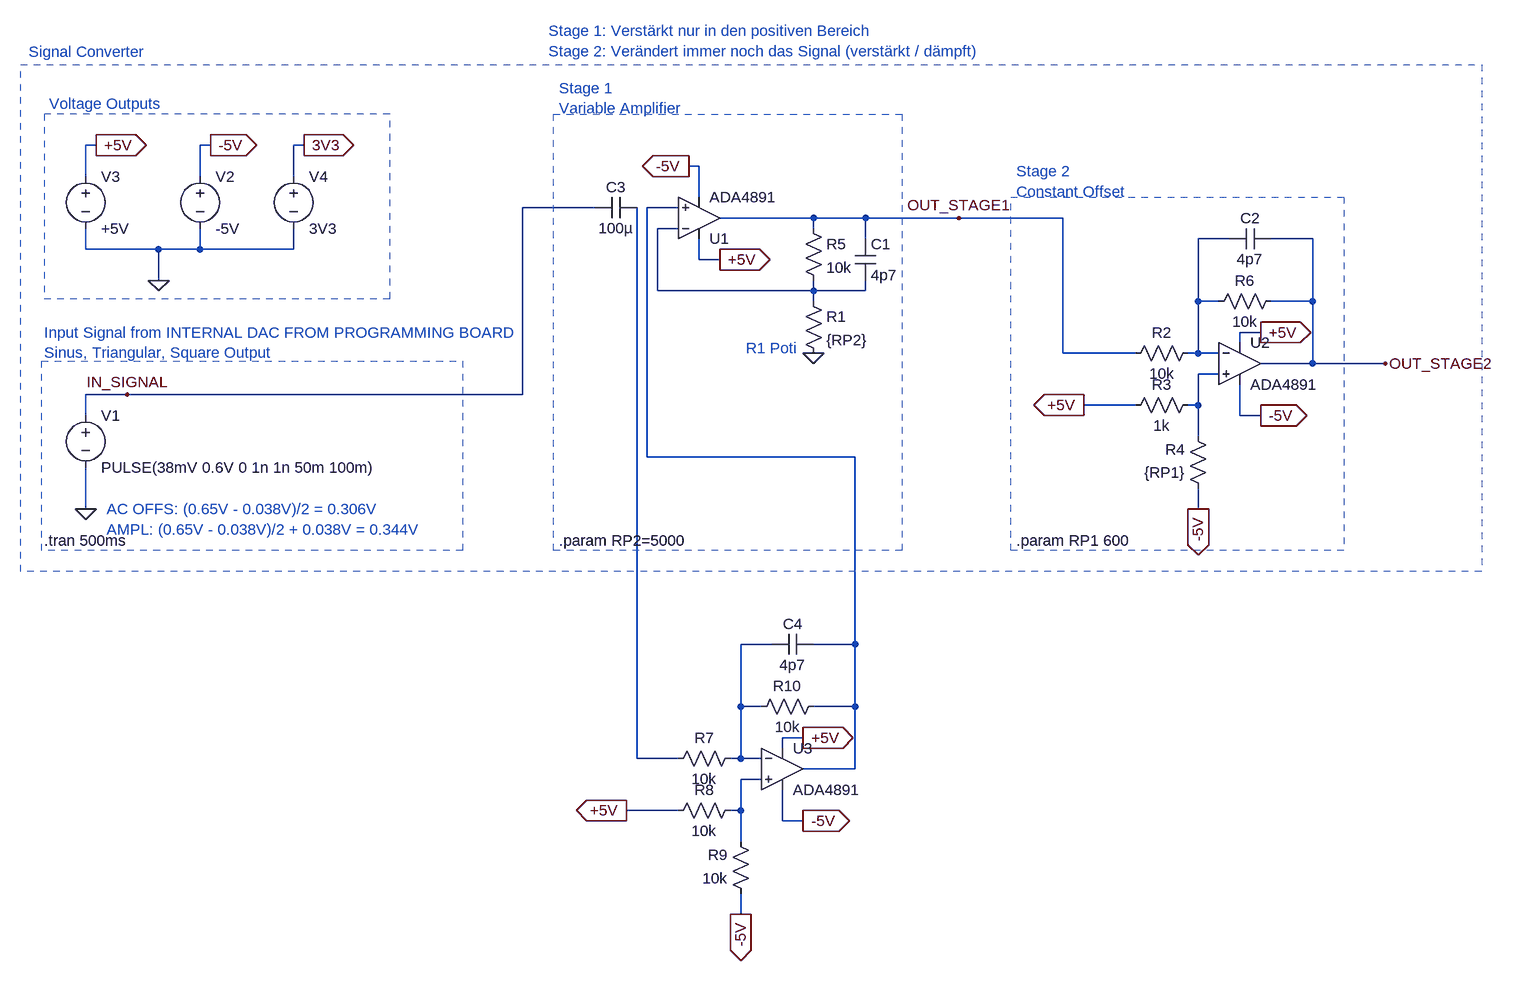
[diagram p0: schematic signal_converter1.asc]
signal_converter1.asc, the LTspice schematic file:
Version 4
SHEET 1 2192 984
WIRE 32 -320 16 -320
WIRE 208 -320 192 -320
WIRE 352 -320 336 -320
WIRE 960 -288 944 -288
WIRE 16 -272 16 -320
WIRE 192 -272 192 -320
WIRE 336 -272 336 -320
WIRE 960 -240 960 -288
WIRE 800 -224 688 -224
WIRE 928 -224 880 -224
WIRE 1136 -208 992 -208
WIRE 1216 -208 1136 -208
WIRE 1360 -208 1216 -208
WIRE 1520 -208 1360 -208
WIRE 928 -192 896 -192
WIRE 1136 -192 1136 -208
WIRE 1216 -176 1216 -208
WIRE 1776 -176 1728 -176
WIRE 1904 -176 1840 -176
WIRE 16 -160 16 -192
WIRE 128 -160 16 -160
WIRE 192 -160 192 -192
WIRE 192 -160 128 -160
WIRE 336 -160 336 -192
WIRE 336 -160 192 -160
WIRE 960 -144 960 -176
WIRE 992 -144 960 -144
WIRE 128 -112 128 -160
WIRE 896 -96 896 -192
WIRE 1136 -96 1136 -112
WIRE 1136 -96 896 -96
WIRE 1216 -96 1216 -112
WIRE 1216 -96 1136 -96
WIRE 1136 -80 1136 -96
WIRE 1728 -80 1728 -176
WIRE 1760 -80 1728 -80
WIRE 1904 -80 1904 -176
WIRE 1904 -80 1840 -80
WIRE 1824 -32 1792 -32
WIRE 1792 -16 1792 -32
WIRE 1520 0 1520 -208
WIRE 1632 0 1520 0
WIRE 1728 0 1728 -80
WIRE 1728 0 1712 0
WIRE 1760 0 1728 0
WIRE 1904 16 1904 -80
WIRE 1904 16 1824 16
WIRE 2016 16 1904 16
WIRE 1760 32 1728 32
WIRE 80 64 16 64
WIRE 688 64 688 -224
WIRE 688 64 80 64
WIRE 1632 80 1552 80
WIRE 1728 80 1728 32
WIRE 1728 80 1712 80
WIRE 16 96 16 64
WIRE 1792 96 1792 48
WIRE 1824 96 1792 96
WIRE 1728 128 1728 80
WIRE 880 160 880 -224
WIRE 1200 160 880 160
WIRE 16 240 16 176
WIRE 1728 240 1728 208
WIRE 1072 448 1024 448
WIRE 1200 448 1200 160
WIRE 1200 448 1136 448
WIRE 1024 544 1024 448
WIRE 1056 544 1024 544
WIRE 1200 544 1200 448
WIRE 1200 544 1136 544
WIRE 1120 592 1088 592
WIRE 1088 608 1088 592
WIRE 864 624 864 -224
WIRE 928 624 864 624
WIRE 1024 624 1024 544
WIRE 1024 624 1008 624
WIRE 1056 624 1024 624
WIRE 1200 640 1200 544
WIRE 1200 640 1120 640
WIRE 1056 656 1024 656
WIRE 928 704 848 704
WIRE 1024 704 1024 656
WIRE 1024 704 1008 704
WIRE 1088 720 1088 672
WIRE 1120 720 1088 720
WIRE 1024 752 1024 704
WIRE 1024 864 1024 832
FLAG 16 240 0
FLAG 128 -112 0
FLAG 32 -320 +5V
IOPIN 32 -320 Out
FLAG 208 -320 -5V
IOPIN 208 -320 Out
FLAG 352 -320 3V3
IOPIN 352 -320 Out
FLAG 80 64 IN_SIGNAL
FLAG 992 -144 +5V
IOPIN 992 -144 Out
FLAG 944 -288 -5V
IOPIN 944 -288 Out
FLAG 1136 0 0
FLAG 1360 -208 OUT_STAGE1
FLAG 1552 80 +5V
IOPIN 1552 80 Out
FLAG 1824 -32 +5V
IOPIN 1824 -32 Out
FLAG 1824 96 -5V
IOPIN 1824 96 Out
FLAG 2016 16 OUT_STAGE2
FLAG 1728 240 -5V
IOPIN 1728 240 Out
FLAG 848 704 +5V
IOPIN 848 704 Out
FLAG 1120 592 +5V
IOPIN 1120 592 Out
FLAG 1120 720 -5V
IOPIN 1120 720 Out
FLAG 1024 864 -5V
IOPIN 1024 864 Out
SYMBOL voltage 16 80 R0
WINDOW 123 0 0 Left 2
WINDOW 39 0 0 Left 2
SYMATTR InstName V1
SYMATTR Value PULSE(38mV 0.6V 0 1n 1n 50m 100m)
SYMBOL voltage 192 -288 R0
WINDOW 123 0 0 Left 2
WINDOW 39 0 0 Left 2
SYMATTR InstName V2
SYMATTR Value -5V
SYMBOL voltage 16 -288 R0
WINDOW 123 0 0 Left 2
WINDOW 39 0 0 Left 2
SYMATTR InstName V3
SYMATTR Value +5V
SYMBOL voltage 336 -288 R0
WINDOW 123 0 0 Left 2
WINDOW 39 0 0 Left 2
SYMATTR InstName V4
SYMATTR Value 3V3
SYMBOL res 1120 -208 R0
SYMATTR InstName R5
SYMATTR Value 10k
SYMBOL cap 1200 -176 R0
SYMATTR InstName C1
SYMATTR Value 4p7
SYMBOL ADA4891 960 -144 M180
SYMATTR InstName U1
SYMBOL /res 1120 -96 R0
SYMATTR InstName R1
SYMATTR Value {RP2}
SYMBOL res 1728 -16 R90
WINDOW 0 0 56 VBottom 2
WINDOW 3 32 56 VTop 2
SYMATTR InstName R2
SYMATTR Value 10k
SYMBOL res 1728 64 R90
WINDOW 0 0 56 VBottom 2
WINDOW 3 32 56 VTop 2
SYMATTR InstName R3
SYMATTR Value 1k
SYMBOL res 1744 224 R180
WINDOW 0 36 76 Left 2
WINDOW 3 36 40 Left 2
SYMATTR InstName R4
SYMATTR Value {RP1}
SYMBOL res 1744 -64 R270
WINDOW 0 32 56 VTop 2
WINDOW 3 0 56 VBottom 2
SYMATTR InstName R6
SYMATTR Value 10k
SYMBOL cap 1840 -192 R90
WINDOW 0 0 32 VBottom 2
WINDOW 3 32 32 VTop 2
SYMATTR InstName C2
SYMATTR Value 4p7
SYMBOL ADA4891 1792 -48 R0
SYMATTR InstName U2
SYMBOL /cap 864 -240 R90
WINDOW 0 0 32 VBottom 2
WINDOW 3 32 32 VTop 2
SYMATTR InstName C3
SYMATTR Value 100µ
SYMBOL res 1024 608 R90
WINDOW 0 0 56 VBottom 2
WINDOW 3 32 56 VTop 2
SYMATTR InstName R7
SYMATTR Value 10k
SYMBOL res 1024 688 R90
WINDOW 0 0 56 VBottom 2
WINDOW 3 32 56 VTop 2
SYMATTR InstName R8
SYMATTR Value 10k
SYMBOL res 1040 848 R180
WINDOW 0 36 76 Left 2
WINDOW 3 36 40 Left 2
SYMATTR InstName R9
SYMATTR Value 10k
SYMBOL res 1040 560 R270
WINDOW 0 32 56 VTop 2
WINDOW 3 0 56 VBottom 2
SYMATTR InstName R10
SYMATTR Value 10k
SYMBOL cap 1136 432 R90
WINDOW 0 0 32 VBottom 2
WINDOW 3 32 32 VTop 2
SYMATTR InstName C4
SYMATTR Value 4p7
SYMBOL ADA4891 1088 576 R0
SYMATTR InstName U3
TEXT -48 288 Left 2 !.tran 500ms
TEXT 48 240 Left 2 ;AC OFFS: (0.65V - 0.038V)/2 = 0.306V\nAMPL: (0.65V - 0.038V)/2 + 0.038V = 0.344V
TEXT -40 -384 Left 2 ;Voltage Outputs
TEXT -48 -32 Left 2 ;Input Signal from INTERNAL DAC FROM PROGRAMMING BOARD\nSinus, Triangular, Square Output
TEXT 744 -408 Left 2 ;Stage 1\nVariable Amplifier
TEXT 1032 -8 Left 2 ;R1 Poti
TEXT 744 288 Left 2 !.param RP2=5000
TEXT 1448 -280 Left 2 ;Stage 2\nConstant Offset
TEXT 1448 288 Left 2 !.param RP1 600
TEXT -72 -464 Left 2 ;Signal Converter
TEXT 728 -496 Left 2 ;Stage 1: Verstärkt nur in den positiven Bereich\nStage 2: Verändert immer noch das Signal (verstärkt / dämpft)
RECTANGLE Normal 484 -368 -48 -84 1
RECTANGLE Normal -52 12 596 304 1
RECTANGLE Normal 736 -368 1272 304 1
RECTANGLE Normal 1952 304 1440 -240 1
RECTANGLE Normal -84 -444 2164 336 1

The netlist it stands for:
* signal_converter1.asc
V1 IN_SIGNAL 0 PULSE(38mV 0.6V 0 1n 1n 50m 100m)
V2 -5V 0 -5V
V3 +5V 0 +5V
V4 3V3 0 3V3
R5 OUT_STAGE1 N002 10k
C1 OUT_STAGE1 N002 4p7
XU1 N001 N002 +5V -5V OUT_STAGE1 ADA4891-1  ; pins In+ In- V+ V- OUT
R1 N002 0 {RP2}
R2 N003 OUT_STAGE1 10k
R3 N004 +5V 1k
R4 -5V N004 {RP1}
R6 N003 OUT_STAGE2 10k
C2 OUT_STAGE2 N003 4p7
XU2 N004 N003 +5V -5V OUT_STAGE2 ADA4891-1  ; pins In+ In- V+ V- OUT
C3 N006 IN_SIGNAL 100µ
R7 N005 N006 10k
R8 N007 +5V 10k
R9 -5V N007 10k
R10 N005 N001 10k
C4 N001 N005 4p7
XU3 N007 N005 +5V -5V N001 ADA4891-1  ; pins In+ In- V+ V- OUT
.tran 500ms
* AC OFFS: (0.65V - 0.038V)/2 = 0.306V
* AMPL: (0.65V - 0.038V)/2 + 0.038V = 0.344V
* Voltage Outputs
* Input Signal from INTERNAL DAC FROM PROGRAMMING BOARD
* Sinus, Triangular, Square Output
* Stage 1
* Variable Amplifier
* R1 Poti
.param RP2=5000
* Stage 2
* Constant Offset
.param RP1 600
* Signal Converter
* Stage 1: Verstärkt nur in den positiven Bereich
* Stage 2: Verändert immer noch das Signal (verstärkt / dämpft)
.lib ADA4891-1.lib
.backanno
.end